# EAGLE design Callisto_v1p0 (EAGLE 9.6.2)
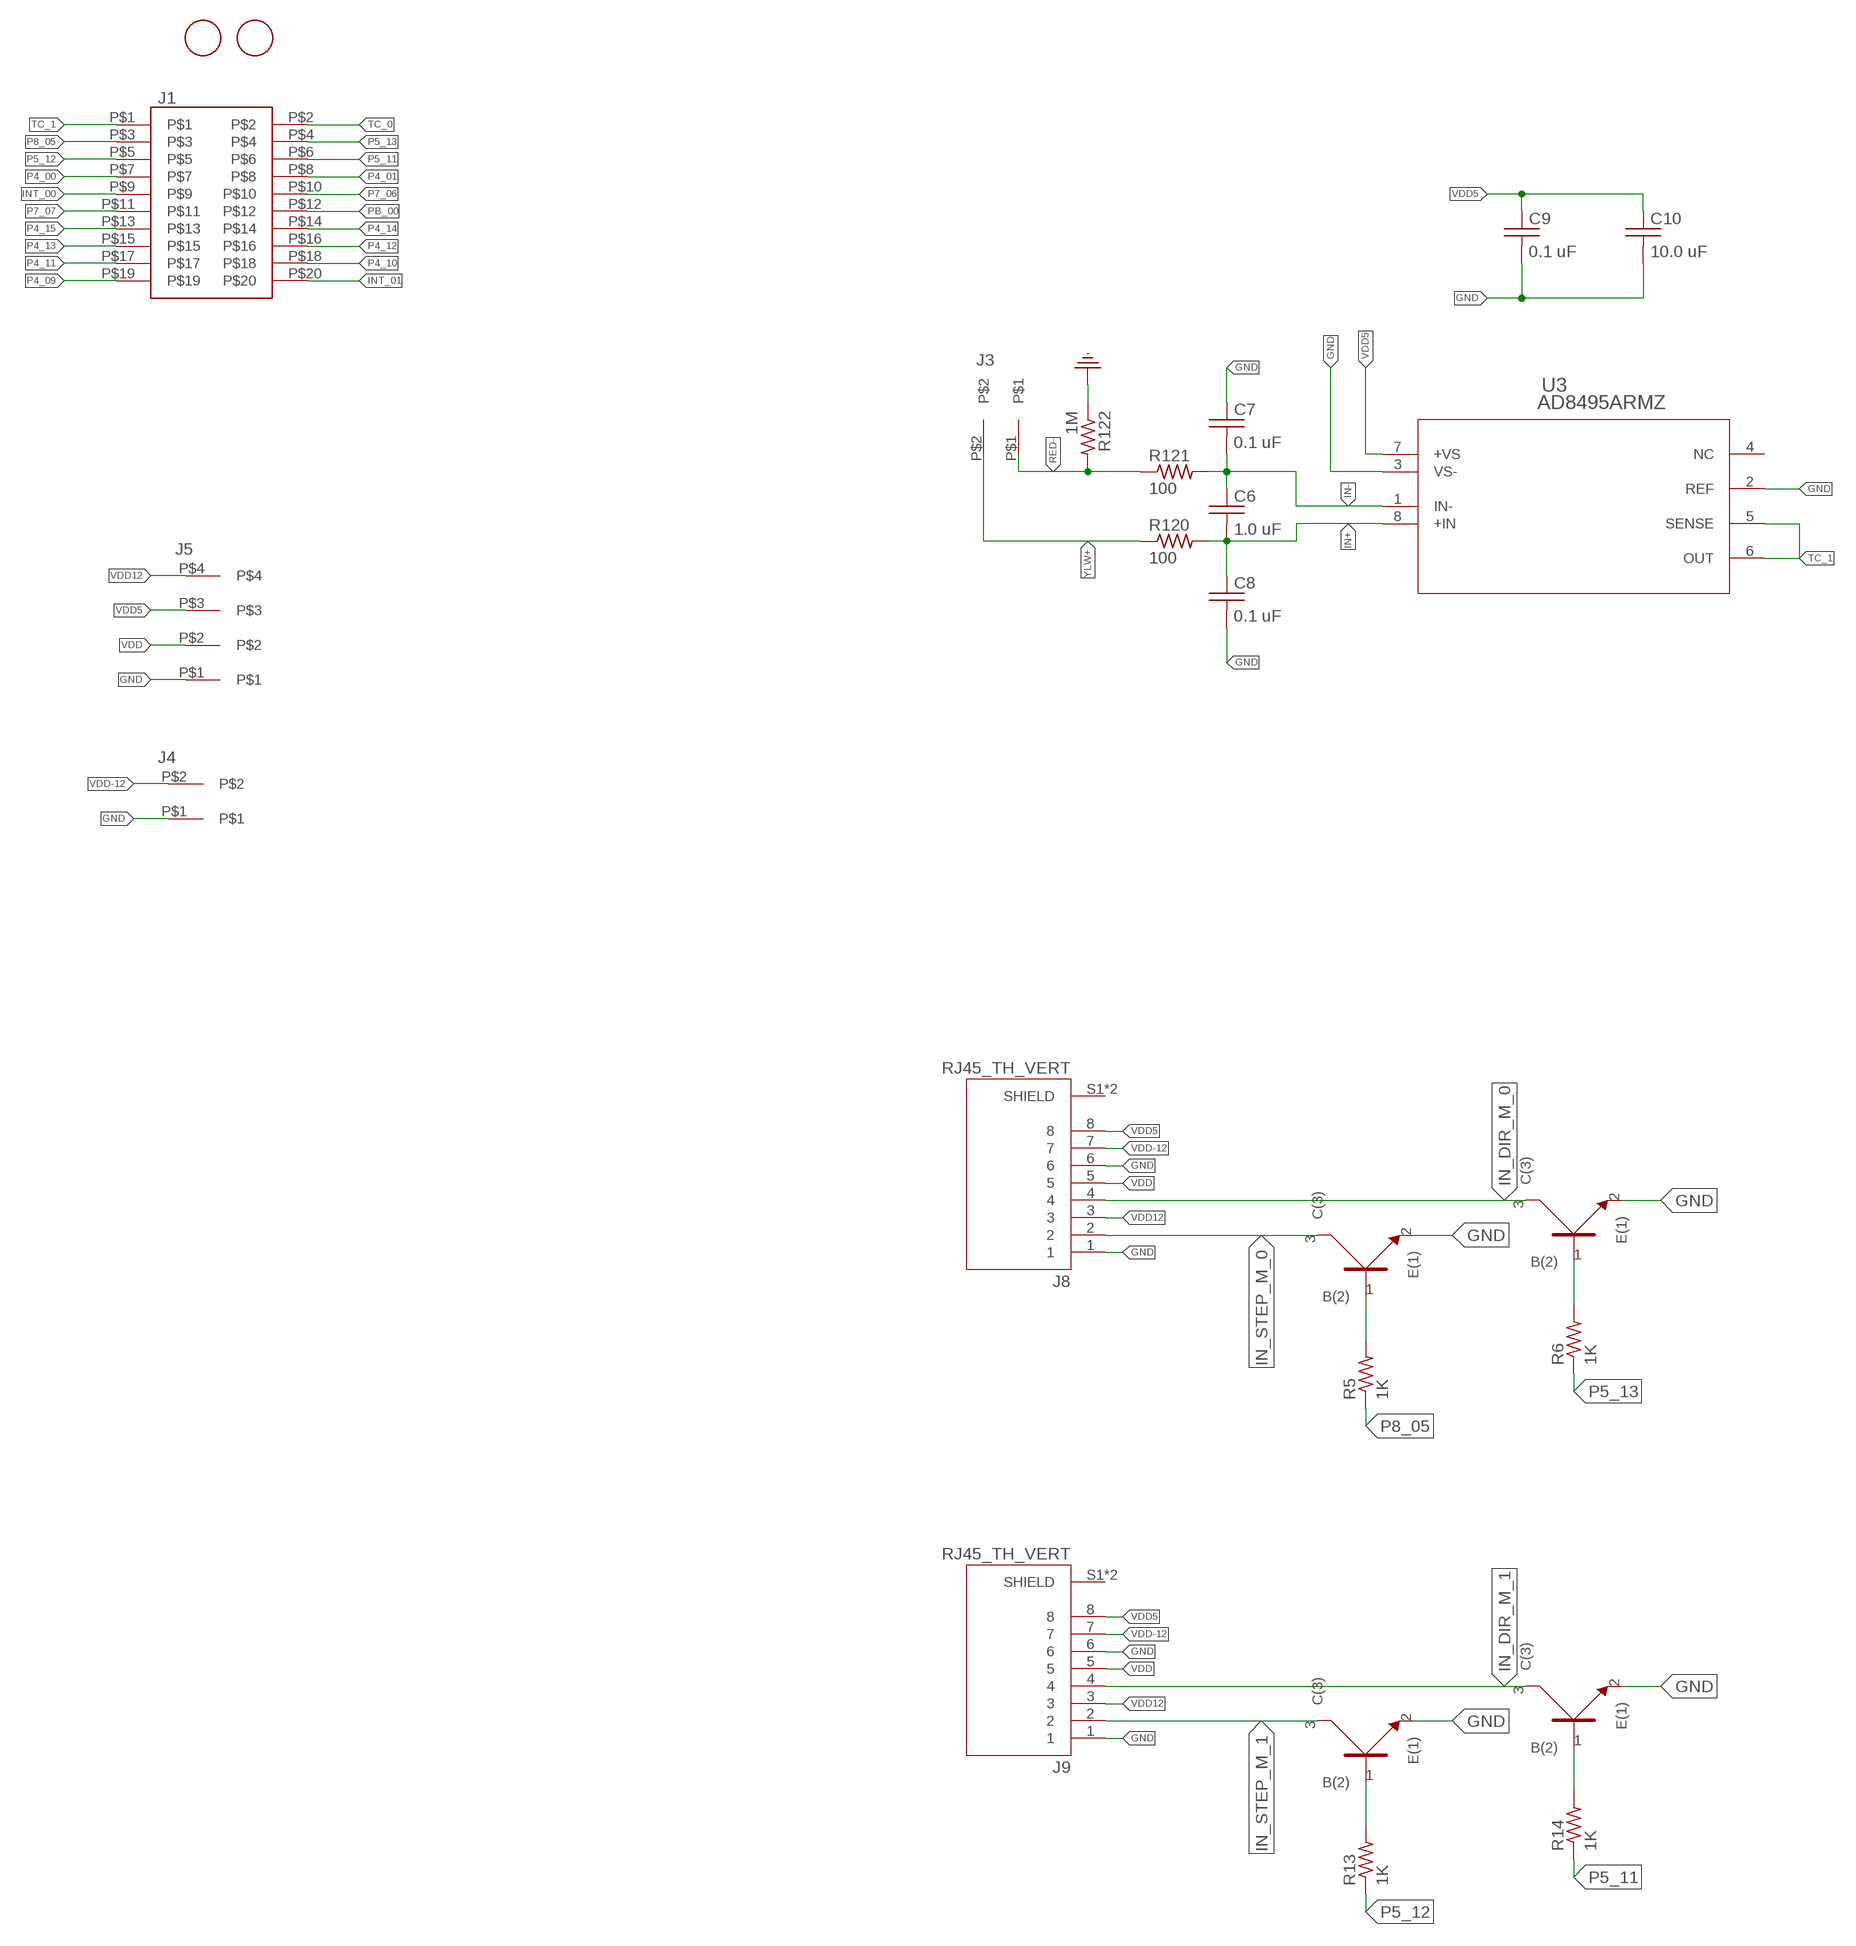
[diagram p0: schematic, sheet 1, part 1 of 2]
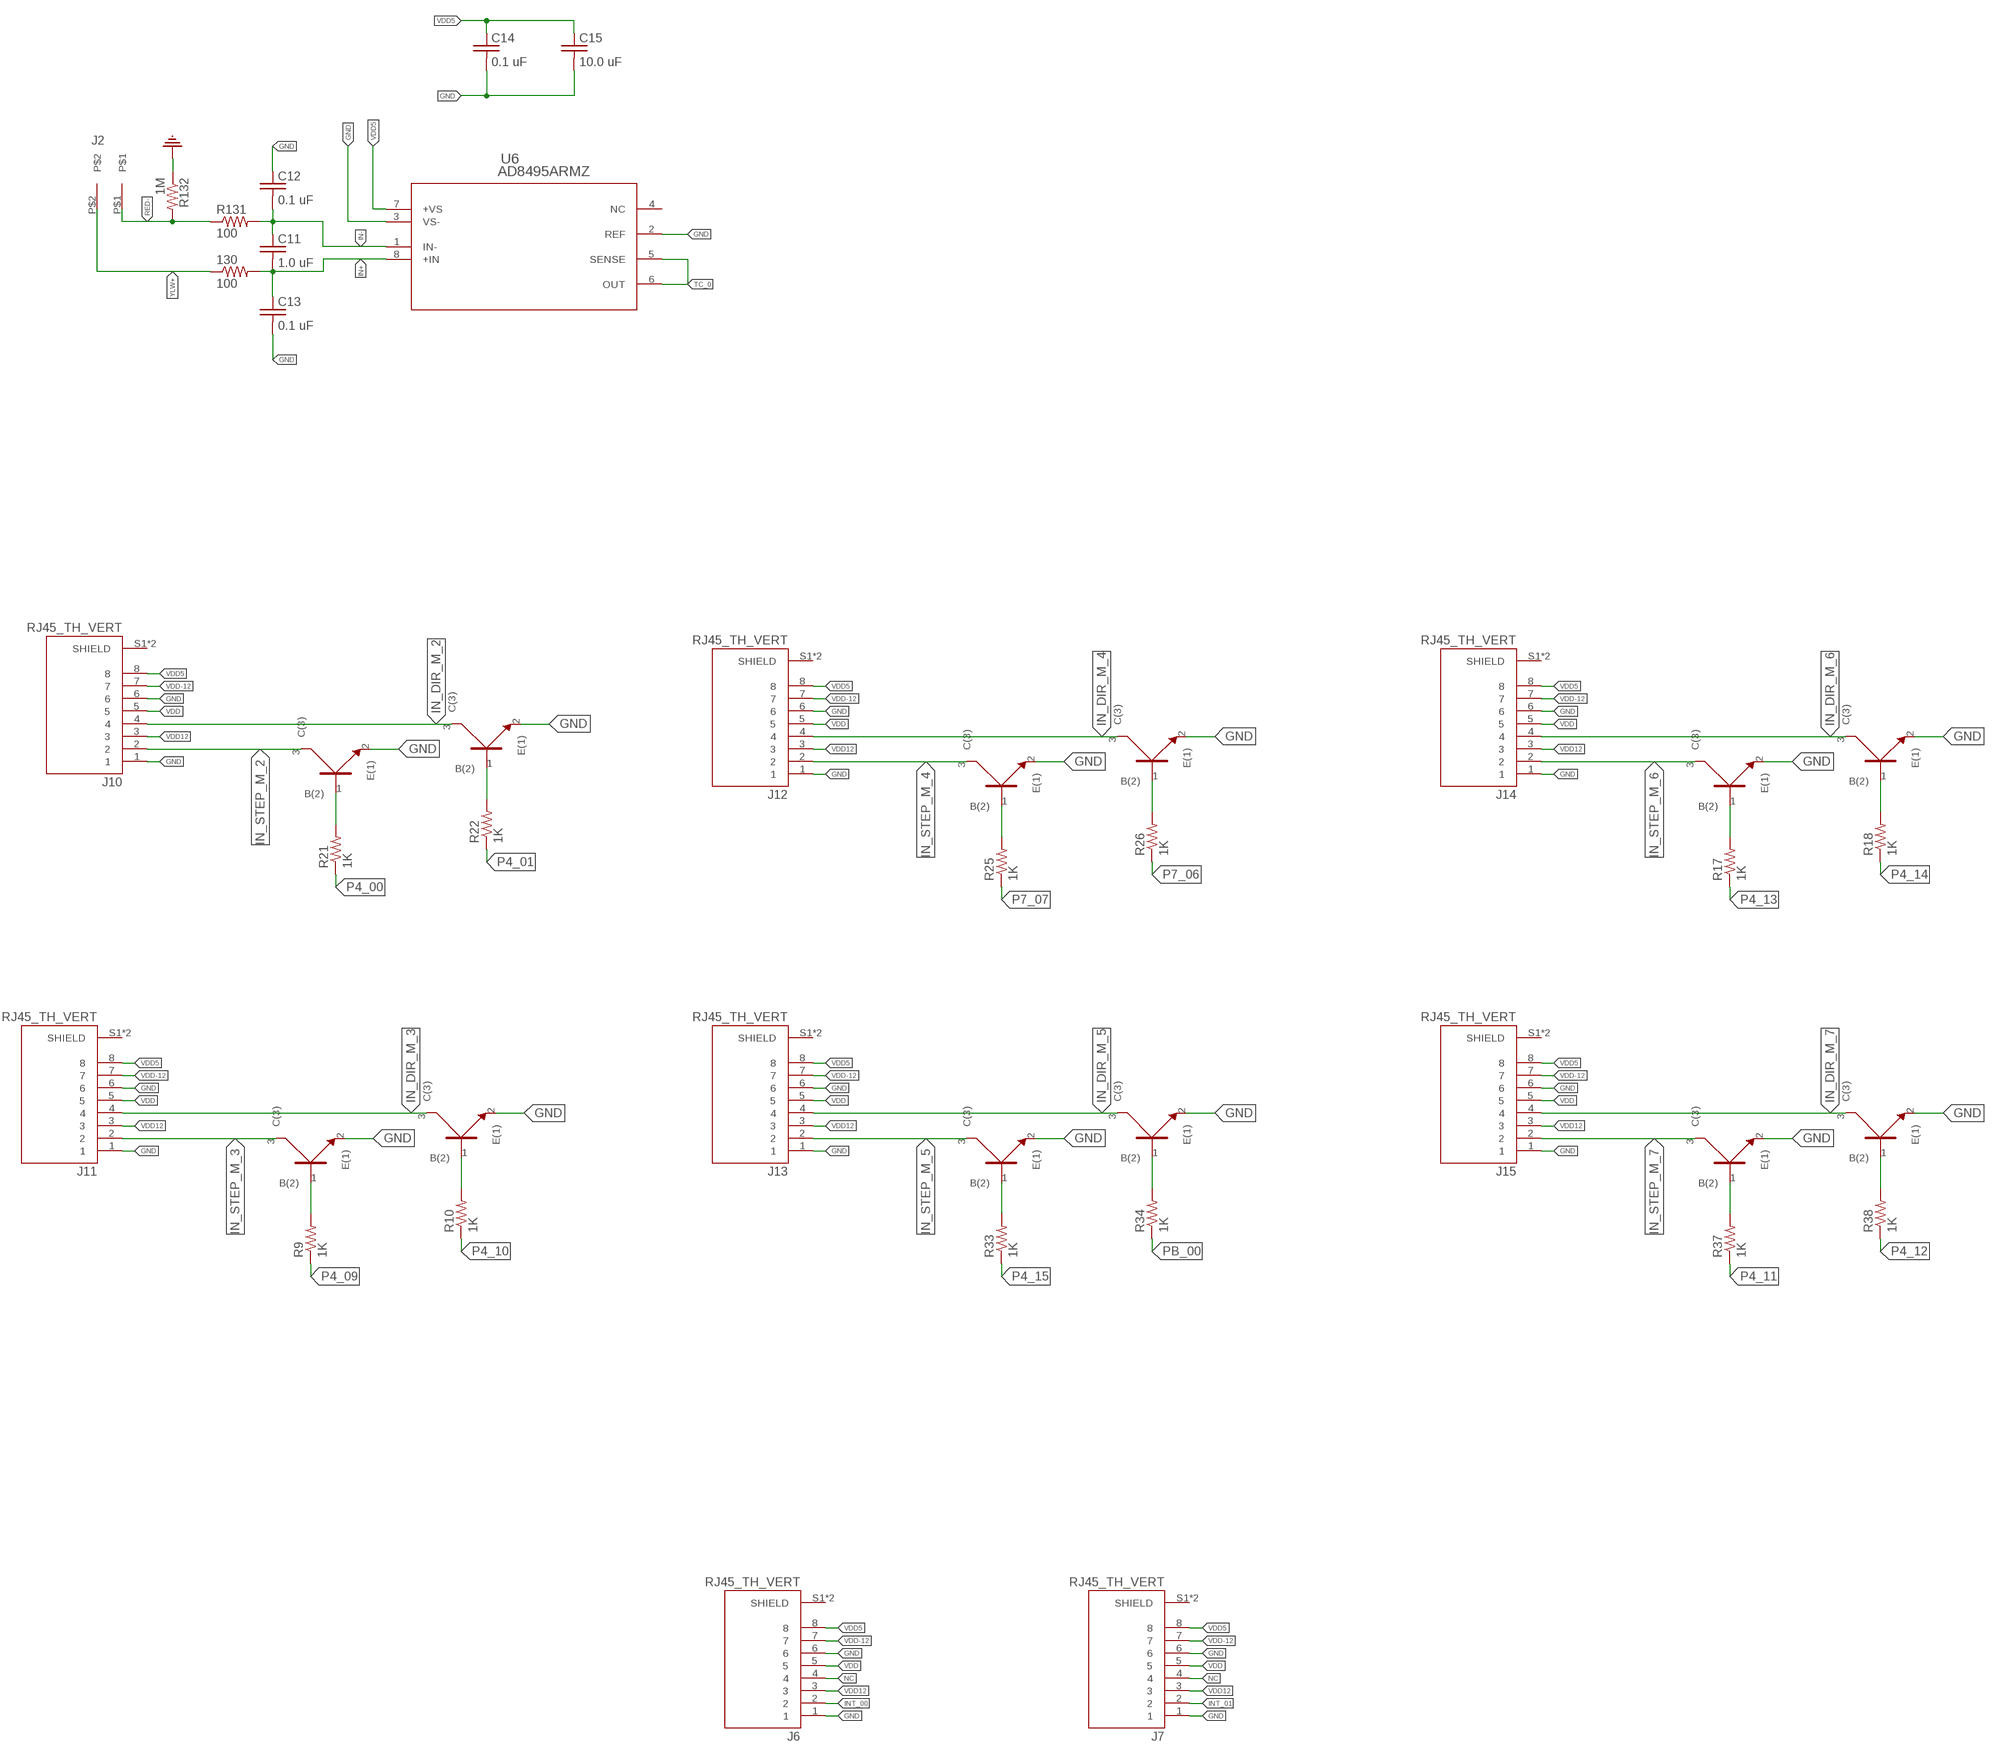
[diagram p1: schematic, sheet 1, part 2 of 2]

## Parts
130  100  R_0402  [0402]
C6  1.0 uF  C_0402  [0402]
C7  0.1 uF  C_0402  [0402]
C8  0.1 uF  C_0402  [0402]
C9  0.1 uF  C_0402  [0402]
C10  10.0 uF  C_0402  [0402]
C11  1.0 uF  C_0402  [0402]
C12  0.1 uF  C_0402  [0402]
C13  0.1 uF  C_0402  [0402]
C14  0.1 uF  C_0402  [0402]
C15  10.0 uF  C_0402  [0402]
J1  20-pos  2_X_10_HEADER_GENERIC  [2_X_10_.1_INCH]
J2  2-pos  3.81MM_1_X_2_RT_ANGLE_PLUG_HEADER  [2_3.81MM_PITCH]
J3  2-pos  3.81MM_1_X_2_RT_ANGLE_PLUG_HEADER  [2_3.81MM_PITCH]
J4  2-pos  3.81MM_1_X_2_RT_ANGLE_PLUG_HEADER  [2_3.81MM_PITCH]
J5  4-pos  3.81MM_1_X_4_RT_ANGLE_PLUG_HEADER  [1X4_3.81MM_PITCH]
J6  RJ45_TH_VERT  [ASSMANN_A-2014-2S-4-N-R]
J7  RJ45_TH_VERT  [ASSMANN_A-2014-2S-4-N-R]
J8  RJ45_TH_VERT  [ASSMANN_A-2014-2S-4-N-R]
J9  RJ45_TH_VERT  [ASSMANN_A-2014-2S-4-N-R]
J10  RJ45_TH_VERT  [ASSMANN_A-2014-2S-4-N-R]
J11  RJ45_TH_VERT  [ASSMANN_A-2014-2S-4-N-R]
J12  RJ45_TH_VERT  [ASSMANN_A-2014-2S-4-N-R]
J13  RJ45_TH_VERT  [ASSMANN_A-2014-2S-4-N-R]
J14  RJ45_TH_VERT  [ASSMANN_A-2014-2S-4-N-R]
J15  RJ45_TH_VERT  [ASSMANN_A-2014-2S-4-N-R]
R5  1K  R_0402  [0402]
R6  1K  R_0402  [0402]
R9  1K  R_0402  [0402]
R10  1K  R_0402  [0402]
R13  1K  R_0402  [0402]
R14  1K  R_0402  [0402]
R17  1K  R_0402  [0402]
R18  1K  R_0402  [0402]
R21  1K  R_0402  [0402]
R22  1K  R_0402  [0402]
R25  1K  R_0402  [0402]
R26  1K  R_0402  [0402]
R33  1K  R_0402  [0402]
R34  1K  R_0402  [0402]
R37  1K  R_0402  [0402]
R38  1K  R_0402  [0402]
R120  100  R_0402  [0402]
R121  100  R_0402  [0402]
R122  1M  R_0402  [0402]
R131  100  R_0402  [0402]
R132  1M  R_0402  [0402]
U1  NPN  BC846BW  [SOT323]
U2  NPN  BC846BW  [SOT323]
U3  AD8495ARMZ  [RM_8_ADI]
U4  NPN  BC846BW  [SOT323]
U5  NPN  BC846BW  [SOT323]
U6  AD8495ARMZ  [RM_8_ADI]
U7  NPN  BC846BW  [SOT323]
U8  NPN  BC846BW  [SOT323]
U9  NPN  BC846BW  [SOT323]
U10  NPN  BC846BW  [SOT323]
U11  NPN  BC846BW  [SOT323]
U12  NPN  BC846BW  [SOT323]
U13  NPN  BC846BW  [SOT323]
U14  NPN  BC846BW  [SOT323]
U17  NPN  BC846BW  [SOT323]
U18  NPN  BC846BW  [SOT323]
U19  NPN  BC846BW  [SOT323]
U20  NPN  BC846BW  [SOT323]
U$1  FIDUCIAL_1MM  [FIDUCIAL_1MM]
U$2  FIDUCIAL_1MM  [FIDUCIAL_1MM]

## Nets
GND: C7.P$1 C8.P$2 C9.P$2 C10.P$2 C12.P$1 C13.P$2 C14.P$2 C15.P$2 J4.P$1 J5.P$1 J6.1 J6.6 J7.1 J7.6 J8.1 J8.6 J9.1 J9.6 J10.1 J10.6 J11.1 J11.6 J12.1 J12.6 J13.1 J13.6 J14.1 J14.6 J15.1 J15.6 R122.P$1 R132.P$1 U1.2(E(1)) U2.2(E(1)) U3.2(REF) U3.3(VS-) U4.2(E(1)) U5.2(E(1)) U6.2(REF) U6.3(VS-) U7.2(E(1)) U8.2(E(1)) U9.2(E(1)) U10.2(E(1)) U11.2(E(1)) U12.2(E(1)) U13.2(E(1)) U14.2(E(1)) U17.2(E(1)) U18.2(E(1)) U19.2(E(1)) U20.2(E(1))
IN+: 130.P$2 C6.P$2 C8.P$1 C11.P$2 C13.P$1 R120.P$2 U3.8(+IN) U6.8(+IN)
IN-: C6.P$1 C7.P$2 C11.P$1 C12.P$2 R121.P$2 R131.P$2 U3.1(IN-) U6.1(IN-)
IN_DIR_M_0: J8.4 U2.3(C(3))
IN_DIR_M_1: J9.4 U8.3(C(3))
IN_DIR_M_2: J10.4 U12.3(C(3))
IN_DIR_M_3: J11.4 U5.3(C(3))
IN_DIR_M_4: J12.4 U14.3(C(3))
IN_DIR_M_5: J13.4 U18.3(C(3))
IN_DIR_M_6: J14.4 U10.3(C(3))
IN_DIR_M_7: J15.4 U20.3(C(3))
IN_STEP_M_0: J8.2 U1.3(C(3))
IN_STEP_M_1: J9.2 U7.3(C(3))
IN_STEP_M_2: J10.2 U11.3(C(3))
IN_STEP_M_3: J11.2 U4.3(C(3))
IN_STEP_M_4: J12.2 U13.3(C(3))
IN_STEP_M_5: J13.2 U17.3(C(3))
IN_STEP_M_6: J14.2 U9.3(C(3))
IN_STEP_M_7: J15.2 U19.3(C(3))
INT_00: J1.P$9 J6.2
INT_01: J1.P$20 J7.2
N$1: R5.P$2 U1.1(B(2))
N$4: R6.P$2 U2.1(B(2))
N$5: R9.P$2 U4.1(B(2))
N$6: R10.P$2 U5.1(B(2))
N$7: R13.P$2 U7.1(B(2))
N$8: R14.P$2 U8.1(B(2))
N$9: R17.P$2 U9.1(B(2))
N$10: R18.P$2 U10.1(B(2))
N$11: R21.P$2 U11.1(B(2))
N$12: R22.P$2 U12.1(B(2))
N$13: R25.P$2 U13.1(B(2))
N$14: R26.P$2 U14.1(B(2))
N$17: R33.P$2 U17.1(B(2))
N$18: R34.P$2 U18.1(B(2))
N$19: R37.P$2 U19.1(B(2))
N$20: R38.P$2 U20.1(B(2))
NC: J6.4 J7.4
P4_00: J1.P$7 R21.P$1
P4_01: J1.P$8 R22.P$1
P4_09: J1.P$19 R9.P$1
P4_10: J1.P$18 R10.P$1
P4_11: J1.P$17 R37.P$1
P4_12: J1.P$16 R38.P$1
P4_13: J1.P$15 R17.P$1
P4_14: J1.P$14 R18.P$1
P4_15: J1.P$13 R33.P$1
P5_11: J1.P$6 R14.P$1
P5_12: J1.P$5 R13.P$1
P5_13: J1.P$4 R6.P$1
P7_06: J1.P$10 R26.P$1
P7_07: J1.P$11 R25.P$1
P8_05: J1.P$3 R5.P$1
PB_00: J1.P$12 R34.P$1
RED-: J2.P$1 J3.P$1 R121.P$1 R122.P$2 R131.P$1 R132.P$2
TC_0: J1.P$2 U6.5(SENSE) U6.6(OUT)
TC_1: J1.P$1 U3.5(SENSE) U3.6(OUT)
VDD: J5.P$2 J6.5 J7.5 J8.5 J9.5 J10.5 J11.5 J12.5 J13.5 J14.5 J15.5
VDD5: C9.P$1 C10.P$1 C14.P$1 C15.P$1 J5.P$3 J6.8 J7.8 J8.8 J9.8 J10.8 J11.8 J12.8 J13.8 J14.8 J15.8 U3.7(+VS) U6.7(+VS)
VDD12: J5.P$4 J6.3 J7.3 J8.3 J9.3 J10.3 J11.3 J12.3 J13.3 J14.3 J15.3
VDD-12: J4.P$2 J6.7 J7.7 J8.7 J9.7 J10.7 J11.7 J12.7 J13.7 J14.7 J15.7
YLW+: 130.P$1 J2.P$2 J3.P$2 R120.P$1
Unconnected: J6.S1(SHIELD) J6.S2(SHIELD) J7.S1(SHIELD) J7.S2(SHIELD) J8.S1(SHIELD) J8.S2(SHIELD) J9.S1(SHIELD) J9.S2(SHIELD) J10.S1(SHIELD) J10.S2(SHIELD) J11.S1(SHIELD) J11.S2(SHIELD) J12.S1(SHIELD) J12.S2(SHIELD) J13.S1(SHIELD) J13.S2(SHIELD) J14.S1(SHIELD) J14.S2(SHIELD) J15.S1(SHIELD) J15.S2(SHIELD) U3.4(NC) U6.4(NC)

## Library data of the parts
130 R5 R6 R9 R10 R13 R14 R17 R18 R21 R22 R25 R26 R33 R34 R37 R38 R120-R122 R131 R132 = 3D_MIG_Controller:R_0402
C6-C15 = 3D_MIG_Controller:C_0402
J1 = 3D_MIG_Controller:2_X_10_HEADER_GENERIC: CONN HEADER R/A 20POS 2.54MM, Straight, Right Angle; PARTNO: 67996-420HLF
J2-J4 = 3D_MIG_Controller:3.81MM_1_X_2_RT_ANGLE_PLUG_HEADER: TERM BLOCK HDR 2POS 90DEG 3.81MM; PARTNO: 691322310002
J5 = 3D_MIG_Controller:3.81MM_1_X_4_RT_ANGLE_PLUG_HEADER: 4 Position Terminal Block Header, Male Pins, Shrouded (4 Side) 0.150" (3.81mm) 90°, Right Angle - Through Hole; PARTNO: 691322310004
J6-J15 = 3D_MIG_Controller:RJ45_TH_VERT: Jack Modular Connector 8p8c (RJ45, Ethernet) Vertical Shielded; DESCRIPTION: Jack Modular Connector 8p8c (RJ45, Ethernet) Vertical Shielded; DIGI-KEY_PART_NUMBER: AE10399-ND; MF: Assmann WSW Components; MP: A-2014-2S-4-N-R; PACKAGE: None
U1 U2 U4 U5 U7-U14 U17-U20 = 3D_MIG_Controller:BC846BW: Bipolar (BJT) Transistor NPN 100MHz Surface Mount SOT-323; PARTNO: BC846BW_NPN
U3 U6 = 3D_MIG_Controller:AD8495ARMZ; BUILT_BY: EMA_UL_Team; MANUFACTURER_PART_NUMBER: AD8495ARMZ; SOURCELIBRARY: Analog_2015-12-15; VENDOR: Analog Devices Inc
U$1 U$2 = 3D_MIG_Controller:FIDUCIAL_1MM: For use by pick and place machines to calibrate the vision/machine, 1mm By microbuilder.eu

## Board
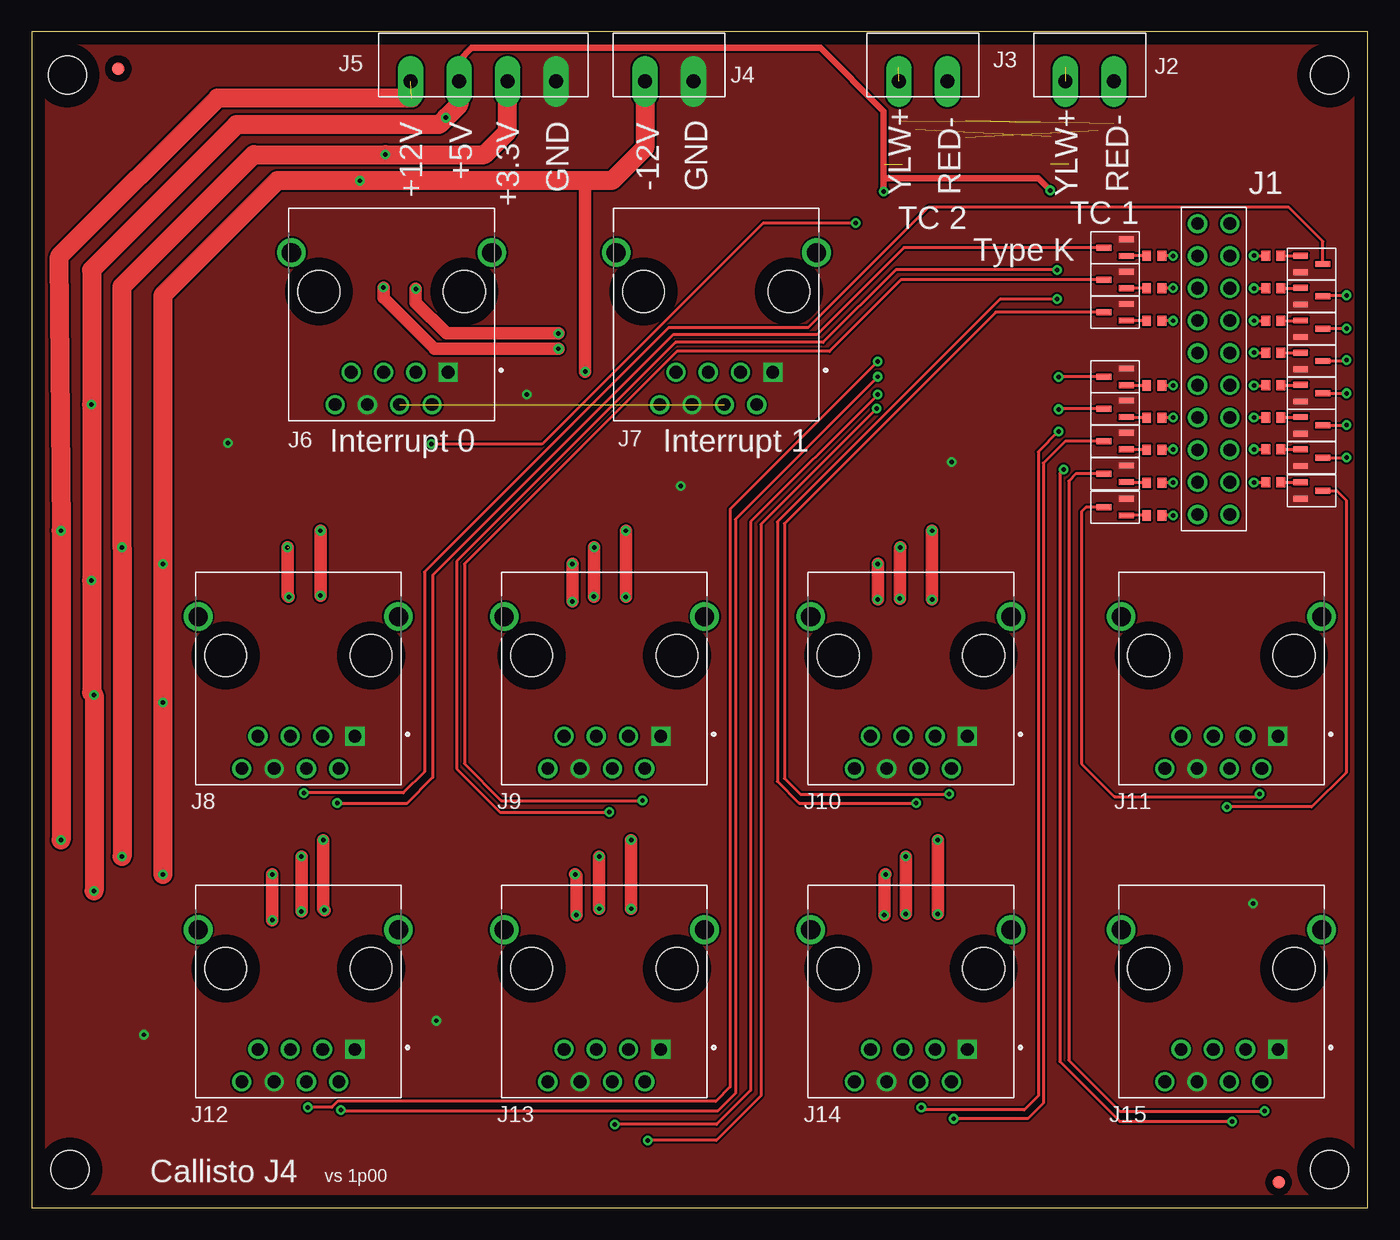
[diagram p2: board, top side]
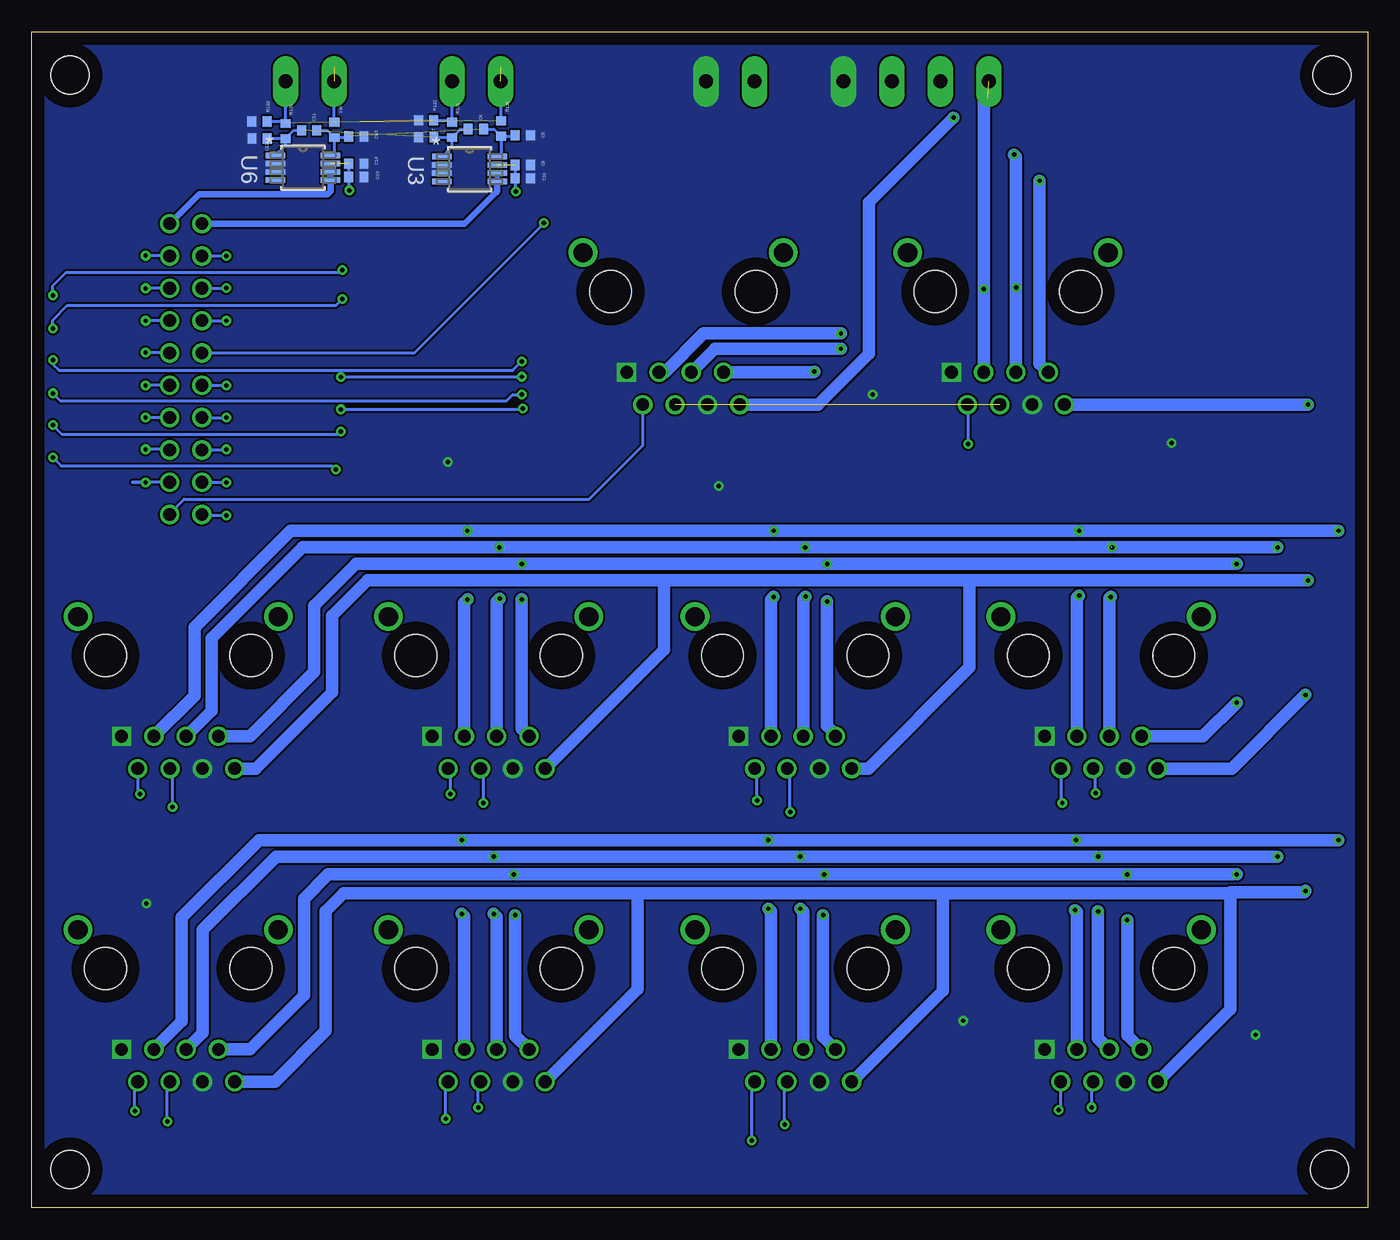
[diagram p3: board, bottom side, seen from below]

Size 105 x 92.4 mm. Coordinates in mm from the lower left corner, seen from the top.
Outline: 0,0 105,0 105,92.4 0,92.4 0,0
Copper layers (1*16): Top 0.035mm / dielectric 1.5mm / Bottom 0.035mm
Design rules "default": minimum track width 6mil, minimum drill 0.35mm, track to track 6mil, track to pad 6mil, pad to pad 6mil, via to via 6mil, smd to smd 6mil, copper to edge 40mil, drill to drill 6mil, minimum pad ring 10mil, minimum via ring 8mil, stop-mask expansion 4mil, vias tented up to drill 0mil, thermal gap 10mil
Holes 3 mm at 102,89 2.8,89 102,3 3,3

### Footprints (pad centres in the part's own frame; a part is rotated, then mirrored left to right if it is on the bottom)
0402 = smd 0.8 x 0.7: P$1 0,0.6; P$2 0,-0.6
2_X_10_.1_INCH = drill 1: P$1 -11.43,-1.27; P$2 -11.43,1.27; P$3 -8.89,-1.27; P$4 -8.89,1.27; P$5 -6.35,-1.27; P$6 -6.35,1.27; P$7 -3.81,-1.27; P$8 -3.81,1.27; P$9 -1.27,-1.27; P$10 -1.27,1.27; P$11 1.27,-1.27; P$12 1.27,1.27; P$13 3.81,-1.27; P$14 3.81,1.27; P$15 6.35,-1.27; P$16 6.35,1.27; P$17 8.89,-1.27; P$18 8.89,1.27; P$19 11.43,-1.27; P$20 11.43,1.27
2_3.81MM_PITCH = drill 1.1 pad 2 long: P$1 0,0; P$2 3.81,0
1X4_3.81MM_PITCH = drill 1.1 pad 2 long: P$1 0,0; P$2 3.81,0; P$3 7.62,0; P$4 11.43,0
ASSMANN_A-2014-2S-4-N-R = drill 1 square: 1 4.445,-6.35 | drill 1: 2 3.175,-8.89; 3 1.905,-6.35; 4 0.635,-8.89; 5 -0.635,-6.35; 6 -1.905,-8.89; 7 -3.175,-6.35; 8 -4.445,-8.89 | drill 1.5: S1 -7.875,3.05; S2 7.875,3.05 | hole 3.3: -5.715,0; 5.715,0
SOT323 = smd 0.457 x 1.168: 1 -0.65,-0.876; 2 0.65,-0.876; 3 0,0.876
RM_8_ADI = smd 1.524 x 0.432: 1 -2.172,0.975; 2 -2.172,0.325; 3 -2.172,-0.325; 4 -2.172,-0.975; 5 2.172,-0.975; 6 2.172,-0.325; 7 2.172,0.325; 8 2.172,0.975
FIDUCIAL_1MM = smd 1 x 1: 1 0,0

### Placement (x,y rotation side)
130  81.22,84.7 0 bottom
C6  70.1,84.76 90 bottom
C7  74,84.12 90 bottom
C8  66.4,84.28 90 bottom
C9  66.4,81.94 90 bottom
C10  66.4,80.9 90 bottom
C11  83.2,84.66 90 bottom
C12  87.1,84.02 90 bottom
C13  79.5,84.18 90 bottom
C14  79.5,82.04 90 bottom
C15  79.5,81 90 bottom
J1  92.9,65.9 270 top
J2  85.06,88.5 180 top
J3  71.96,88.5 180 top
J4  52,88.5 180 top
J5  41.2,88.5 180 top
J6  28.28,72 0 top
J7  53.8,72 0 top
J8  20.95,43.4 0 top
J9  45,43.4 0 top
J10  69.1,43.4 0 top
J11  93.5,43.4 0 top
J12  20.95,18.8 0 top
J13  45,18.8 0 top
J14  69.1,18.8 0 top
J15  93.5,18.8 0 top
R5  88.22,74.8 270 top
R6  97.58,74.8 90 top
R9  88.22,54.4 270 top
R10  97.58,57 90 top
R13  88.22,72.24 270 top
R14  97.58,72.26 90 top
R17  88.22,59.57 270 top
R18  97.58,62.1 90 top
R21  88.22,69.71 270 top
R22  97.58,69.69 90 top
R25  88.22,64.61 270 top
R26  97.58,67.18 90 top
R33  88.22,62.08 270 top
R34  97.58,64.64 90 top
R37  88.22,56.97 270 top
R38  97.58,59.59 90 top
R120  68.12,84.8 0 bottom
R121  71.96,84.7 0 bottom
R122  74.01,85.46 90 bottom
R131  85.06,84.6 0 bottom
R132  87.11,85.36 90 bottom
U1  85.14,75.44 90 top
U2  100.59,74.16 270 top
U3  70.59,81.62 0 bottom
U4  85.14,55.05 90 top
U5  100.59,56.35 270 top
U6  83.69,81.72 0 bottom
U7  85.14,72.91 90 top
U8  100.59,71.63 270 top
U9  85.14,60.24 90 top
U10  100.59,61.48 270 top
U11  85.14,70.37 90 top
U12  100.59,69.07 270 top
U13  85.14,65.29 90 top
U14  100.59,66.54 270 top
U17  85.14,62.78 90 top
U18  100.59,64.01 270 top
U19  85.14,57.68 90 top
U20  100.59,58.94 270 top
U$1  6.8,89.5 0 top
U$2  98,2 0 top

### Tracks (layer width: path | path; a pad name or v marks a point on that pad's centre or on a via)
GND  (via drill 0.35)
  other vias: 96,23.9 31.8,14.7 8.8,13.6 38.9,63.9 15.4,60.1 51,56.7 72.3,58.6
  pour Top (no thermals): 0,92.4 105,92.4 105,0 0,0
  pour Bottom (no thermals): 0,92.4 105,92.4 105,0 0,0
IN+  (1 unrouted)
  Bottom 0.254: R120.P$2 68.12,82.89 U3.8 | C6.P$2 68.68,84.76 R120.P$2 | R120.P$2 67.08,84.2 C8.P$1 | 130.P$2 81.22,82.99 U6.8 | C11.P$2 81.78,84.66 130.P$2 | 130.P$2 80.18,84.1 C13.P$1
IN-  (1 unrouted)
  Bottom 0.254: U3.1 71.96,83.4 R121.P$2 | R121.P$2 71.3,84.76 C6.P$1 | C7.P$2 71.98,84.12 R121.P$2 | U6.1 85.06,83.5 R131.P$2 | R131.P$2 84.4,84.66 C11.P$1 | C12.P$2 85.08,84.02 R131.P$2
IN_DIR_M_0  (via drill 0.35)
  Top 0.254: U2.3 101.47,75.93 98.8,78.6 70.47,78.6 61.02,69.16 50.06,69.16 30.86,49.96 30.86,34.26 29.2,32.6 v21.4,32.6
  Bottom 0.254: v21.4,32.6 21.4,34.33 J8.4
IN_DIR_M_1  (via drill 0.35)
  Top 0.254: U8.3 101.54,71.7 v103.35,71.7 | v80.6,73.7 67.9,73.7 62.2,68 50.6,68 33.4,50.8 33.4,34.5 36.8,31.1 v45.4,31.1
  Bottom 0.254: v103.35,71.7 103.35,72.45 102.3,73.5 80.8,73.5 v80.6,73.7 | v45.4,31.1 45.4,34.27 J9.4
IN_DIR_M_2  (via drill 0.35)
  Top 0.254: U12.3 101.5,69.1 v103.35,69.1 | v80.6,71.4 76.1,71.4 58.6,53.9 58.6,33.5 60.3,31.8 v69.5,31.8
  Bottom 0.254: v69.5,31.8 69.5,34.27 J10.4 | v103.35,69.1 103.35,69.75 102.2,70.9 81.1,70.9 v80.6,71.4
IN_DIR_M_3  (via drill 0.35)
  Top 0.254: U5.3 102.55,56.35 103.3,55.6 103.3,34.2 100.6,31.5 v93.93,31.5
  Bottom 0.254: v93.93,31.5 93.93,34.3 J11.4
IN_DIR_M_4  (via drill 0.35)
  Top 0.254: U14.3 103.29,66.54 v103.35,66.6 | v66.5,66.5 54.89,54.89 54.89,9.49 53.76,8.36 24.03,8.36 23.57,7.9 v21.7,7.9
  Bottom 0.254: v103.35,66.6 103.35,66.3 102.85,65.8 67.2,65.8 v66.5,66.5 | v21.7,7.9 21.7,9.79 J12.4
IN_DIR_M_5  (via drill 0.35)
  Top 0.254: U18.3 v103.34,64.01 v103.35,64 | v66.5,63.9 56.5,53.9 56.5,9.22 53.84,6.56 v45.83,6.56
  Bottom 0.254: v103.35,64 102.75,63.4 67.7,63.4 67.2,63.9 v66.5,63.9 | v45.83,6.56 45.83,9.71 J13.4
IN_DIR_M_6  (via drill 0.35)
  Top 0.254: U10.3 103.33,61.48 v103.35,61.5 | v80.7,61 79.1,59.4 79.1,8.8 78,7.7 70.11,7.7 v69.92,7.89
  Bottom 0.254: v103.35,61.5 102.65,60.8 80.9,60.8 v80.7,61 | v69.92,7.89 69.94,7.91 69.94,9.61
  Bottom 0.406: J14.4 69.73,9.81 69.94,9.61
IN_DIR_M_7  (via drill 0.35)
  Top 0.254: U20.3 103.33,58.94 v103.35,58.96 | v81.1,58 80.8,57.7 80.8,11.5 85.51,6.79 v94.35,6.79
  Bottom 0.254: v103.35,58.96 102.69,58.3 81.4,58.3 v81.1,58 | v94.35,6.79 94.35,9.7 J15.4
IN_STEP_M_0  (via drill 0.35)
  Top 0.254: U1.3 68.54,75.44 61.7,68.6 50.4,68.6 31.52,49.72 31.52,33.81 29.5,31.8 v24,31.8
  Bottom 0.254: J8.2 24.12,31.93 v24,31.8
IN_STEP_M_1  (via drill 0.35)
  Top 0.254: U7.3 68.31,72.91 62.7,67.3 50.7,67.3 34,50.6 34,34.9 36.9,32 v48,32
  Bottom 0.254: v48,32 48,34.34 J9.2
IN_STEP_M_2  (via drill 0.35)
  Top 0.254: v72.1,32.5 60.4,32.5 59.15,33.75 59.15,53.75 75.77,70.37 80.6,70.37 U11.3
  Bottom 0.254: v72.1,32.5 72.1,34.34 J10.2
IN_STEP_M_3  (via drill 0.35)
  Top 0.254: U4.3 82.85,55.05 82.5,54.7 82.5,34.9 85.1,32.3 96.3,32.3 v96.5,32.5
  Bottom 0.254: J11.2 96.67,32.67 v96.5,32.5
IN_STEP_M_4  (via drill 0.35)
  Top 0.254: 80.49,65.29 v80.7,65.29 U13.3 | v66.5,65.3 55.3,54.1 55.3,9 53.9,7.6 24.4,7.6 v24.3,7.7
  Bottom 0.254: v80.7,65.29 v66.51,65.29 v66.5,65.3 | v24.3,7.7 24.12,7.88 J12.2
IN_STEP_M_5  (via drill 0.35)
  Top 0.254: U17.3 80.74,62.78 v80.7,62.74 | v66.4,62.8 57.3,53.7 57.3,8.8 53.8,5.3 v48.4,5.3
  Bottom 0.254: v80.7,62.74 66.46,62.74 v66.4,62.8 | v48.4,5.3 48.4,9.69 J13.2
IN_STEP_M_6  (via drill 0.35)
  Top 0.254: U9.3 81.24,60.24 79.51,58.51 79.51,8.21 78.3,7 v72.47,7
  Bottom 0.254: v72.47,7 72.47,9.71 J14.2
IN_STEP_M_7  (via drill 0.35)
  Top 0.254: U19.3 82.08,57.68 81.5,57.1 81.5,11.6 85.5,7.6 v96.9,7.6
  Bottom 0.254: v96.9,7.6 96.9,9.69 J15.2
INT_00  (via drill 0.35)
  Top 0.254: v64.77,77.37 57.47,77.37 40.1,60 v31.4,60
  Bottom 0.254: J1.P$9 74.93,67.17 64.77,77.33 v64.77,77.37 | v31.4,60 31.4,63.05 J6.2
INT_01
  Bottom 0.254: J1.P$20 94.17,54.53 93.02,55.68 61.2,55.68 56.98,59.9 J7.2
N$1
  Top 0.254: R5.P$2 86.03,74.8 U1.1
N$4
  Top 0.254: R6.P$2 U2.1
N$5
  Top 0.254: R9.P$2 U4.1
N$6
  Top 0.254: R10.P$2 U5.1
N$7
  Top 0.254: R13.P$2 86.04,72.24 U7.1
N$8
  Top 0.254: R14.P$2 99.7,72.26 U8.1
N$9
  Top 0.254: R17.P$2 86.04,59.57 U9.1
N$10
  Top 0.254: R18.P$2 99.69,62.1 U10.1
N$11
  Top 0.254: R21.P$2 86.03,69.71 U11.1
N$12
  Top 0.254: R22.P$2 99.69,69.69 U12.1
N$13
  Top 0.254: R25.P$2 86.05,64.61 U13.1
N$14
  Top 0.254: R26.P$2 U14.1
N$17
  Top 0.254: R33.P$2 86.07,62.08 U17.1
N$18
  Top 0.254: R34.P$2 99.7,64.64 U18.1
N$19
  Top 0.254: R37.P$2 86.08,56.97 U19.1
N$20
  Top 0.254: R38.P$2 U20.1
NC  (1 unrouted)
P4_00  (via drill 0.35)
  Top 0.254: v89.69,69.7 R21.P$1
  Bottom 0.254: J1.P$7 89.7,69.71 v89.69,69.7
P4_01  (via drill 0.35)
  Top 0.254: v96.05,69.7 96.97,69.7 R22.P$1
  Bottom 0.254: J1.P$8 v96.04,69.71 v96.05,69.7
P4_09  (via drill 0.35)
  Top 0.254: v89.69,54.4 R9.P$1
  Bottom 0.254: J1.P$19 91.56,54.4 v89.69,54.4
P4_10  (via drill 0.35)
  Top 0.254: v96.05,57 R10.P$1
  Bottom 0.254: J1.P$18 97.09,57.01 97.08,57 v96.05,57
P4_11  (via drill 0.35)
  Top 0.254: v89.69,57 89.67,56.97 R37.P$1
  Bottom 0.254: J1.P$17 89.7,57.01 v89.69,57
P4_12  (via drill 0.35)
  Top 0.254: v96.05,59.6 96.97,59.6 R38.P$1
  Bottom 0.254: J1.P$16 94.22,59.6 v96.05,59.6
P4_13  (via drill 0.35)
  Top 0.254: v89.69,59.6 88.85,59.6 R17.P$1
  Bottom 0.254: J1.P$15 89.75,59.55 v89.69,59.6
P4_14  (via drill 0.35)
  Top 0.254: v96.05,62.1 R18.P$1
  Bottom 0.254: J1.P$14 v96.04,62.09 v96.05,62.1
P4_15  (via drill 0.35)
  Top 0.254: v89.69,62.1 89.67,62.08 R33.P$1
  Bottom 0.254: J1.P$13 89.7,62.09 v89.69,62.1
P5_11  (via drill 0.35)
  Top 0.254: v96.05,72.25 96.97,72.25 R14.P$1
  Bottom 0.254: J1.P$6 v96.05,72.25
P5_12  (via drill 0.35)
  Top 0.254: v89.69,72.28 89.66,72.24 R13.P$1
  Bottom 0.254: J1.P$5 89.72,72.25 v89.69,72.28
P5_13  (via drill 0.35)
  Top 0.254: v96.05,74.81 96.97,74.81 R6.P$1
  Bottom 0.254: J1.P$4 96.03,74.79 v96.05,74.81
P7_06  (via drill 0.35)
  Top 0.254: v96.05,67.2 96.95,67.2 R26.P$1
  Bottom 0.254: J1.P$10 96.02,67.17 v96.05,67.2
P7_07  (via drill 0.35)
  Top 0.254: v89.69,64.6 R25.P$1
  Bottom 0.254: J1.P$11 89.72,64.63 v89.69,64.6
P8_05  (via drill 0.35)
  Top 0.254: v89.69,74.8 R5.P$1
  Bottom 0.254: J1.P$3 89.7,74.79 v89.69,74.8
PB_00  (via drill 0.35)
  Top 0.254: v96.05,64.6 96.94,64.6 R34.P$1
  Bottom 0.254: J1.P$12 96.02,64.63 v96.05,64.6
RED-  (1 unrouted)
  Bottom 0.254: R122.P$2 72.12,85.46 R121.P$1 J3.P$1 | R132.P$2 85.22,85.36 R131.P$1 J2.P$1
TC_0
  Bottom 0.508: U6.6 U6.5 81.52,79.88 81.75,79.65 91.85,79.65 J1.P$2
TC_1
  Bottom 0.406: 68.45,79.85 68.45,79.75 | U3.6 U3.5
  Bottom 0.508: U3.5 68.42,79.88 68.45,79.85 70.97,77.33 J1.P$1
VDD  (via drill 0.35)  (1 unrouted)
  Top 1: v44.18,48.02 44.18,51.88 v44.2,51.9 | v68.23,47.87 68.23,51.83 v68.27,51.9 | v20.2,48 20.1,48.1 v20.1,51.9 | v68.7,23.1 v68.7,27.6 | v21.2,23.3 v21.2,27.6 | v44.6,23.5 v44.6,27.6 | v41.4,67.5 31.64,67.5 27.64,71.5 v27.64,72.3
  Top 1.5: v7.1,27.6 v7.1,51.9 7.1,72.4 17.45,82.75 v27.8,82.75 35.58,82.75 37.39,84.55 J5.P$2
  Bottom 1: J15.5 91.56,13.76 91.56,21.86 85.81,27.6 v68.7,27.6 v44.6,27.6 v21.2,27.6 v7.1,27.6 | J11.5 90.86,39.06 90.86,44.76 83.71,51.9 v68.27,51.9 v44.2,51.9 20.2,51.9 | v20.1,51.9 v7.1,51.9 | v44.18,48.02 44.37,47.84 J9.5 | J10.5 68.47,47.63 v68.23,47.87 | v20.2,48 20.32,47.88 J8.5 | J14.5 68.47,22.86 v68.7,23.1 | J12.5 21.2,13.34 v21.2,23.3 | J13.5 44.37,23.27 v44.6,23.5 | J6.5 v27.64,72.3 27.64,82.59 v27.8,82.75 | J7.5 51.31,67.5 v41.4,67.5
VDD5  (via drill 0.35)  (2 unrouted)
  Top 0.508: J5.P$3 33.58,90.14 34.57,91.13 61.99,91.13 66.95,86.17 66.95,80.9 | 66.95,80.9 v66.95,79.85 | v80.05,79.95 79.1,80.9 66.95,80.9
  Top 1.5: v4.9,24.9 v4.9,40.3 4.7,40.5 v4.7,49.3 v4.7,63.11 4.7,73.7 16.1,85.1 32,85.1 v32.55,85.65 33.58,86.68 J5.P$3
  Bottom 0.254: C9.P$1 C10.P$1 67,79.9 v66.95,79.85 | C14.P$1 C15.P$1 80.1,79.95 v80.05,79.95
  Bottom 1: 10.8,24.7 33.4,24.7 | 33.4,24.7 57.4,24.7 | 57.4,24.7 80.5,24.7 81.9,23.3 81.9,13.9 85.89,9.91 J15.8 | J14.8 57.4,17.16 57.4,24.7 | J13.8 33.4,17.07 33.4,24.7 | J12.8 10.8,15.62 10.8,24.7 | 10.8,24.7 10.8,24.8 5,24.8 v4.9,24.9 | J10.8 55.3,43.87 55.3,49.3 | J11.8 87.41,34.51 81.4,40.52 81.4,46.52 78.61,49.3 55.3,49.3 | v4.7,49.3 31.3,49.3 | 31.3,49.3 55.3,49.3 | J9.8 39.26,34.51 31.3,42.47 31.3,49.3 | J8.8 10.69,34.51 v4.9,40.3 | J6.8 v4.71,63.11 v4.7,63.11 | J7.8 43.19,63.11 39.2,67.1 39.2,79 v32.55,85.65
VDD12  (via drill 0.35)  (1 unrouted)
  Top 1: v46.7,48 v46.7,53.2 | v70.75,47.81 v70.75,53.2 | v22.7,48.1 v22.7,53.2 | v71.2,23.1 v71.2,28.9 | v23,23.4 22.9,23.5 v22.9,28.9 | v47.1,23.5 v47.1,28.9 | v41.4,68.7 32.59,68.7 30.18,71.1 v30.18,72.2
  Top 1.5: v2.3,28.9 v2.3,53.2 2.33,53.3 2.17,74.77 14.6,87.2 29.87,87.2
  Bottom 1: J15.3 93.21,14.65 93.21,22.81 87.12,28.9 v71.2,28.9 v47.1,28.9 v22.9,28.9 v2.3,28.9 | J11.3 92.21,40.25 92.21,45.63 84.64,53.2 v70.75,53.2 v46.7,53.2 v22.7,53.2 v2.3,53.2 | J9.3 46.91,47.8 v46.7,48 | J10.3 71,47.55 v70.75,47.81 | J8.3 22.86,47.95 v22.7,48.1 | v71.2,23.1 71,22.91 J14.3 | v23,23.4 22.86,23.25 J12.3 | v47.1,23.5 46.91,23.3 J13.3 | J6.3 v30.18,72.2 30.18,88.08 J5.P$4 | J7.3 55.25,65.65 52.2,68.7 v41.4,68.7
VDD-12  (via drill 0.35)
  Top 1: v42.49,50.6 v42.49,47.64 | v66.5,47.8 v66.5,50.6 | v18.9,22.6 v18.9,26.2 | v42.8,23 42.8,26.1 v42.7,26.2 | v67,23 67,26.1 v67.1,26.2 | v43.5,65.7 43.5,80.7
  Top 1.5: J4.P$2 48.19,83.29 45.6,80.7 43.5,80.7 v25.8,80.7 19.3,80.7 10.3,71.7 v10.3,50.6 v10.3,39.7 v10.3,26.2
  Bottom 1: J8.7 12.95,37.05 v10.3,39.7 | J11.7 87.86,37.05 82.8,42.11 82.8,47.3 79.5,50.6 v66.5,50.6 v42.49,50.6 v10.3,50.6 | J9.7 41.83,37.21 42.49,37.88 v42.49,47.64 | J10.7 66.5,37.62 v66.5,47.8 | J15.7 87.85,12.45 83.6,16.7 83.6,24.3 81.7,26.2 v67.1,26.2 v42.7,26.2 v18.9,26.2 v10.3,26.2 | J12.7 18.9,13.57 v18.9,22.6 | J13.7 42.8,13.43 v42.8,23 | J14.7 67,13.53 v67,23 | J7.7 43.55,65.65 v43.5,65.7 | J6.7 25.14,65.65 25.8,66.31 v25.8,80.7
YLW+  (3 unrouted)
  Bottom 0.254: 68.14,85.42 R120.P$1 | R120.P$1 68.15,85.43 | R120.P$1 68.12,89.63 | 81.24,85.32 130.P$1 | 130.P$1 81.25,85.33 | 130.P$1 81.22,89.63

### Text on the board
tPlace: Interrupt 0 | Interrupt 1 | Callisto J4 | vs 1p00
tNames: +5V | GND | -12V | GND | YLW+ | RED- | YLW+ | RED- | +12V | +3.3V | TC 2 | TC 1 | Type K